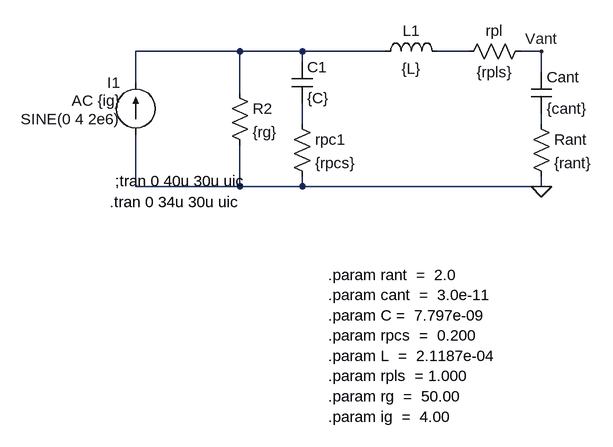
[diagram p0: schematic eje2para.asc]
eje2para.asc, the LTspice schematic file:
Version 4
SHEET 1 880 680
WIRE -112 -128 -272 -128
WIRE -16 -128 -112 -128
WIRE 112 -128 -16 -128
WIRE 240 -128 192 -128
WIRE 352 -128 320 -128
WIRE -16 -112 -16 -128
WIRE 352 -96 352 -128
WIRE -272 -80 -272 -128
WIRE -112 -64 -112 -128
WIRE -16 -16 -16 -48
WIRE 352 -16 352 -32
WIRE -272 80 -272 0
WIRE -112 80 -112 16
WIRE -112 80 -272 80
WIRE -16 80 -16 64
WIRE -16 80 -112 80
WIRE 352 80 352 64
WIRE 352 80 -16 80
FLAG 352 80 0
FLAG 352 -128 Vant
SYMBOL res 336 -32 R0
SYMATTR InstName Rant
SYMATTR Value {rant}
SYMBOL cap -32 -112 R0
SYMATTR InstName C1
SYMATTR Value {C}
SYMATTR SpiceLine Rser=0
SYMBOL ind 96 -112 R270
WINDOW 0 32 56 VTop 2
WINDOW 3 5 56 VBottom 2
SYMATTR InstName L1
SYMATTR Value {L}
SYMATTR SpiceLine Rser=0
SYMBOL res -32 -32 R0
SYMATTR InstName rpc1
SYMATTR Value {rpcs}
SYMBOL res 336 -144 R90
WINDOW 0 0 56 VBottom 2
WINDOW 3 32 56 VTop 2
SYMATTR InstName rpl
SYMATTR Value {rpls}
SYMBOL res -128 -80 R0
SYMATTR InstName R2
SYMATTR Value {rg}
SYMBOL current -272 0 R180
WINDOW 0 24 80 Left 2
WINDOW 3 24 24 Left 2
WINDOW 123 24 52 Left 2
WINDOW 39 0 0 Left 2
SYMATTR InstName I1
SYMATTR Value SINE(0 4 2e6)
SYMATTR Value2 AC {ig}
SYMBOL cap 336 -96 R0
SYMATTR InstName Cant
SYMATTR Value {cant}
TEXT -304 72 Left 2 !;tran 0 40u 30u uic
TEXT 24 216 Left 2 !.param rant  =  2.0 \n.param cant  =  3.0e-11 \n.param C =  7.797e-09 \n.param rpcs  =  0.200 \n.param L  =  2.1187e-04 \n.param rpls  = 1.000 \n.param rg  =  50.00 \n.param ig  =  4.00
TEXT -312 104 Left 2 !.tran 0 34u 30u uic

The netlist it stands for:
* eje2para.asc
Rant N004 0 {rant}
C1 N001 N003 {C} Rser=0
L1 N001 N002 {L} Rser=0
rpc1 N003 0 {rpcs}
rpl Vant N002 {rpls}
R2 N001 0 {rg}
I1 0 N001 SINE(0 4 2e6) AC {ig}
Cant Vant N004 {cant}
;tran 0 40u 30u uic
.param rant  =  2.0
.param cant  =  3.0e-11
.param C =  7.797e-09
.param rpcs  =  0.200
.param L  =  2.1187e-04
.param rpls  = 1.000
.param rg  =  50.00
.param ig  =  4.00
.tran 0 34u 30u uic
.backanno
.end